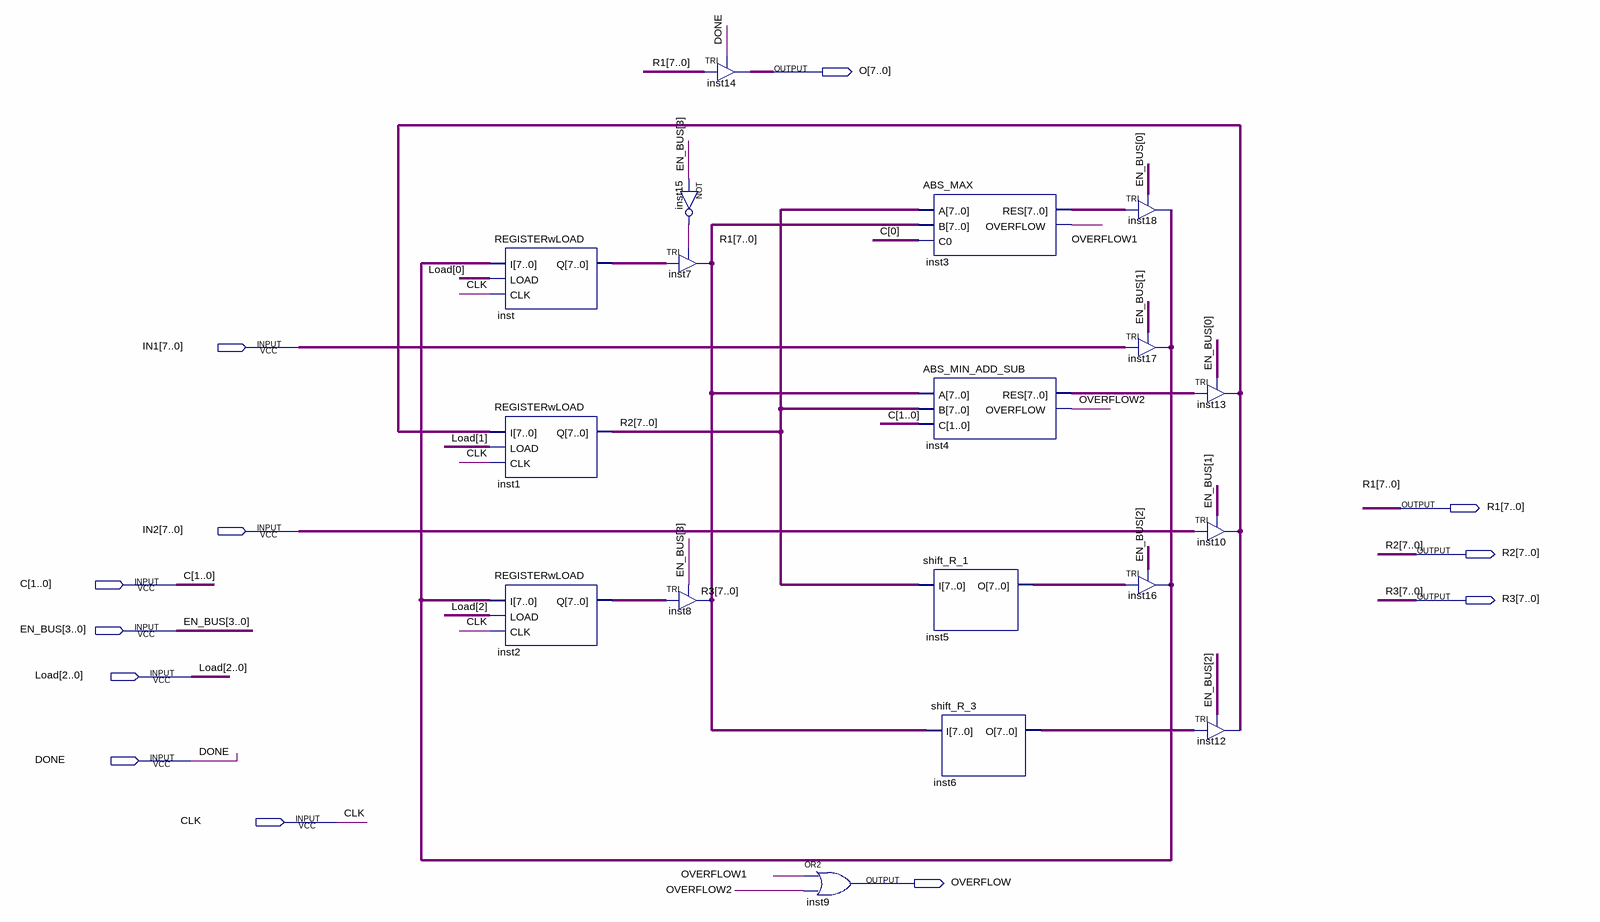
[diagram p0: schematic sheet]
// Quartus schematic DATAPATH_3.bdf as structural Verilog: 18 symbols, 12 pins
module DATAPATH_3 (
  input  [7:0] IN1,
  input  [7:0] IN2,
  input  [1:0] C,
  input  [3:0] EN_BUS,
  input  [2:0] Load,
  input  DONE,
  input  CLK,
  output [7:0] O,
  output [7:0] R1,
  output [7:0] R2,
  output [7:0] R3,
  output OVERFLOW
);

  wire inst15_out, OVERFLOW1, OVERFLOW2;
  wire [7:0] inst3_res, inst4_res, inst5_o, inst6_o, inst7_out, inst13_out, inst18_out;

  REGISTERwLOAD inst (.I(inst18_out), .LOAD(Load[0]), .CLK(CLK), .Q(R1));
  REGISTERwLOAD inst1 (.I(inst13_out), .LOAD(Load[1]), .CLK(CLK), .Q(R2));
  REGISTERwLOAD inst2 (.I(inst18_out), .LOAD(Load[2]), .CLK(CLK), .Q(R3));
  TRI inst14[7:0] (.IN(R1), .OE(DONE), .OUT(O));
  not inst15 (inst15_out, EN_BUS[3]);
  TRI inst7[7:0] (.IN(R1), .OE(inst15_out), .OUT(inst7_out));
  TRI inst8[7:0] (.IN(R3), .OE(EN_BUS[3]), .OUT(inst7_out));
  or inst9 (OVERFLOW, OVERFLOW1, OVERFLOW2);
  ABS_MAX inst3 (.A(R2), .B(inst7_out), .C0(C[0]), .RES(inst3_res), .OVERFLOW(OVERFLOW1));
  ABS_MIN_ADD_SUB inst4 (.A(inst7_out), .B(R2), .C(C), .RES(inst4_res), .OVERFLOW(OVERFLOW2));
  shift_R_1 inst5 (.I(R2), .O(inst5_o));
  shift_R_3 inst6 (.I(inst7_out), .O(inst6_o));
  TRI inst18[7:0] (.IN(inst3_res), .OE(EN_BUS[0]), .OUT(inst18_out));
  TRI inst17[7:0] (.IN(IN1), .OE(EN_BUS[1]), .OUT(inst18_out));
  TRI inst16[7:0] (.IN(inst5_o), .OE(EN_BUS[2]), .OUT(inst18_out));
  TRI inst13[7:0] (.IN(inst4_res), .OE(EN_BUS[0]), .OUT(inst13_out));
  TRI inst10[7:0] (.IN(IN2), .OE(EN_BUS[1]), .OUT(inst13_out));
  TRI inst12[7:0] (.IN(inst6_o), .OE(EN_BUS[2]), .OUT(inst13_out));
endmodule
